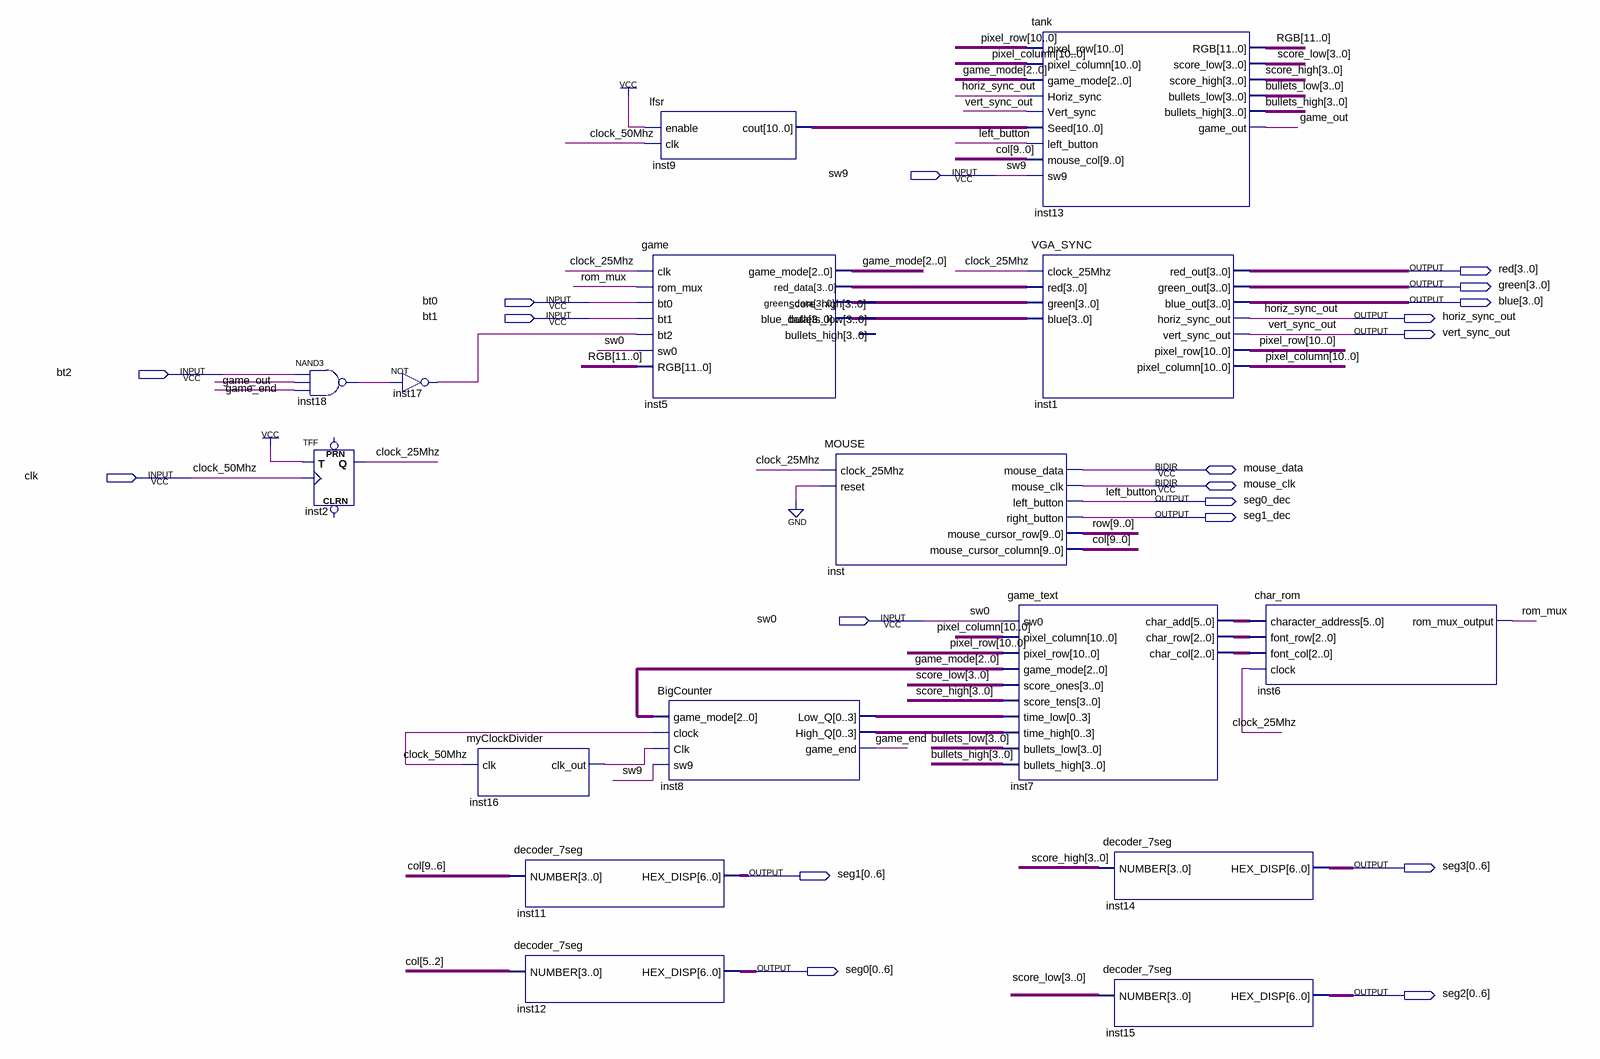
[diagram p0: schematic sheet]
// Quartus schematic Miniproject.bdf as structural Verilog: 16 symbols, 19 pins
module Miniproject (
  input  sw9,
  input  bt0,
  input  bt1,
  input  bt2,
  input  clk,
  input  sw0,
  inout  mouse_data,
  inout  mouse_clk,
  output [3:0] red,
  output [3:0] green,
  output [3:0] blue,
  output horiz_sync_out,
  output vert_sync_out,
  output seg0_dec,
  output seg1_dec,
  output [0:6] seg3,
  output [0:6] seg1,
  output [0:6] seg0,
  output [0:6] seg2
);

  wire clock_25Mhz, game_end, game_out, inst16_clk_out, inst17_out, inst18_out, rom_mux;
  wire [2:0] game_mode, inst7_char_col, inst7_char_row;
  wire [3:0] bullets_high, bullets_low, inst5_bullets_low, inst5_red_data, inst5_score_high, inst8_high_q,
       inst8_low_q, score_high, score_low;
  wire [5:0] inst7_char_add;
  wire [9:0] col, row;
  wire [10:0] inst9_cout, pixel_column, pixel_row;
  wire [11:0] RGB;

  nand inst18 (inst18_out, bt2, game_out, game_end);
  TFF inst2 (.T(1'b1), .CLK(clk), .Q(clock_25Mhz));  // open: PRN, CLRN
  not inst17 (inst17_out, inst18_out);
  myClockDivider inst16 (.clk(clk), .clk_out(inst16_clk_out));
  decoder_7seg inst11 (.NUMBER(col[9:6]), .HEX_DISP(seg1));
  decoder_7seg inst12 (.NUMBER(col[5:2]), .HEX_DISP(seg0));
  lfsr inst9 (.enable(1'b1), .clk(clk), .cout(inst9_cout));
  game inst5 (
    .clk(clock_25Mhz), .rom_mux(rom_mux), .bt0(bt0), .bt1(bt1), .bt2(inst17_out), .sw0(sw0), .RGB(RGB),
    .game_mode(game_mode), .red_data(inst5_red_data), .score_high(inst5_score_high),
    .bullets_low(inst5_bullets_low), .blue_data(inst5_bullets_low));  // open: bullets_high, green_data
  BigCounter inst8 (
    .game_mode(game_mode), .clock(clk), .Clk(inst16_clk_out), .sw9(sw9), .Low_Q(inst8_low_q),
    .High_Q(inst8_high_q), .game_end(game_end));
  MOUSE inst (
    .clock_25Mhz(clock_25Mhz), .reset(1'b0), .left_button(seg0_dec), .right_button(seg1_dec),
    .mouse_cursor_row(row), .mouse_cursor_column(col), .mouse_data(mouse_data), .mouse_clk(mouse_clk));
  tank inst13 (
    .pixel_row(pixel_row), .pixel_column(pixel_column), .game_mode(game_mode), .Horiz_sync(horiz_sync_out),
    .Vert_sync(vert_sync_out), .Seed(inst9_cout), .left_button(seg0_dec), .mouse_col(col), .sw9(sw9),
    .RGB(RGB), .score_low(score_low), .score_high(score_high), .bullets_low(bullets_low),
    .bullets_high(bullets_high), .game_out(game_out));
  VGA_SYNC inst1 (
    .clock_25Mhz(clock_25Mhz), .red(inst5_red_data), .green(inst5_score_high), .blue(inst5_bullets_low),
    .red_out(red), .green_out(green), .blue_out(blue), .horiz_sync_out(horiz_sync_out),
    .vert_sync_out(vert_sync_out), .pixel_row(pixel_row), .pixel_column(pixel_column));
  game_text inst7 (
    .sw0(sw0), .pixel_column(pixel_column), .pixel_row(pixel_row), .game_mode(game_mode),
    .score_ones(score_low), .score_tens(score_high), .time_low(inst8_low_q), .time_high(inst8_high_q),
    .bullets_low(bullets_low), .bullets_high(bullets_high), .char_add(inst7_char_add),
    .char_row(inst7_char_row), .char_col(inst7_char_col));
  decoder_7seg inst14 (.NUMBER(score_high), .HEX_DISP(seg3));
  decoder_7seg inst15 (.NUMBER(score_low), .HEX_DISP(seg2));
  char_rom inst6 (
    .character_address(inst7_char_add), .font_row(inst7_char_row), .font_col(inst7_char_col),
    .clock(clock_25Mhz), .rom_mux_output(rom_mux));

  // Other names for the same wires on the sheet: clock_50Mhz = clk; left_button = seg0_dec
endmodule
